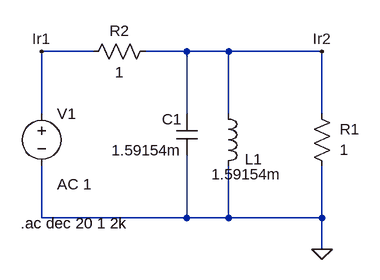
[diagram p0: schematic Parallel RLC BandStop Filter.asc]
Parallel RLC BandStop Filter.asc, the LTspice schematic file:
Version 4
SHEET 1 880 680
WIRE 112 96 32 96
WIRE 256 96 192 96
WIRE 320 96 256 96
WIRE 464 96 320 96
WIRE 32 192 32 96
WIRE 256 192 256 96
WIRE 320 192 320 96
WIRE 464 192 464 96
WIRE 32 352 32 272
WIRE 256 352 256 256
WIRE 256 352 32 352
WIRE 320 352 320 272
WIRE 320 352 256 352
WIRE 464 352 464 272
WIRE 464 352 320 352
WIRE 464 400 464 352
FLAG 464 96 Ir2
FLAG 464 400 0
FLAG 32 96 Ir1
SYMBOL res 480 288 R180
WINDOW 0 -42 72 Left 2
WINDOW 3 -25 41 Left 2
SYMATTR InstName R1
SYMATTR Value 1
SYMBOL cap 272 256 R180
WINDOW 0 24 56 Left 2
WINDOW 3 24 8 Left 2
SYMATTR InstName C1
SYMATTR Value 1.59154m
SYMBOL ind 304 176 R0
WINDOW 0 41 86 Left 2
WINDOW 3 -10 109 Left 2
SYMATTR InstName L1
SYMATTR Value 1.59154m
SYMBOL voltage 32 176 R0
WINDOW 123 24 124 Left 2
WINDOW 39 0 0 Left 0
SYMATTR Value2 AC 1
SYMATTR InstName V1
SYMATTR Value ""
SYMBOL res 208 80 R90
WINDOW 0 0 56 VBottom 2
WINDOW 3 32 56 VTop 2
SYMATTR InstName R2
SYMATTR Value 1
TEXT 0 360 Left 2 !.ac dec 20 1 2k

The netlist it stands for:
* Parallel RLC BandStop Filter.asc
R1 0 Ir2 1
C1 0 Ir2 1.59154m
L1 Ir2 0 1.59154m
V1 Ir1 0 AC 1
R2 Ir2 Ir1 1
.ac dec 20 1 2k
.backanno
.end